# Altium schematic sheet MAX16998A Watchdog Circuit.SchDoc: Watchdog Circuit
size Letter; SheetNumber: 15
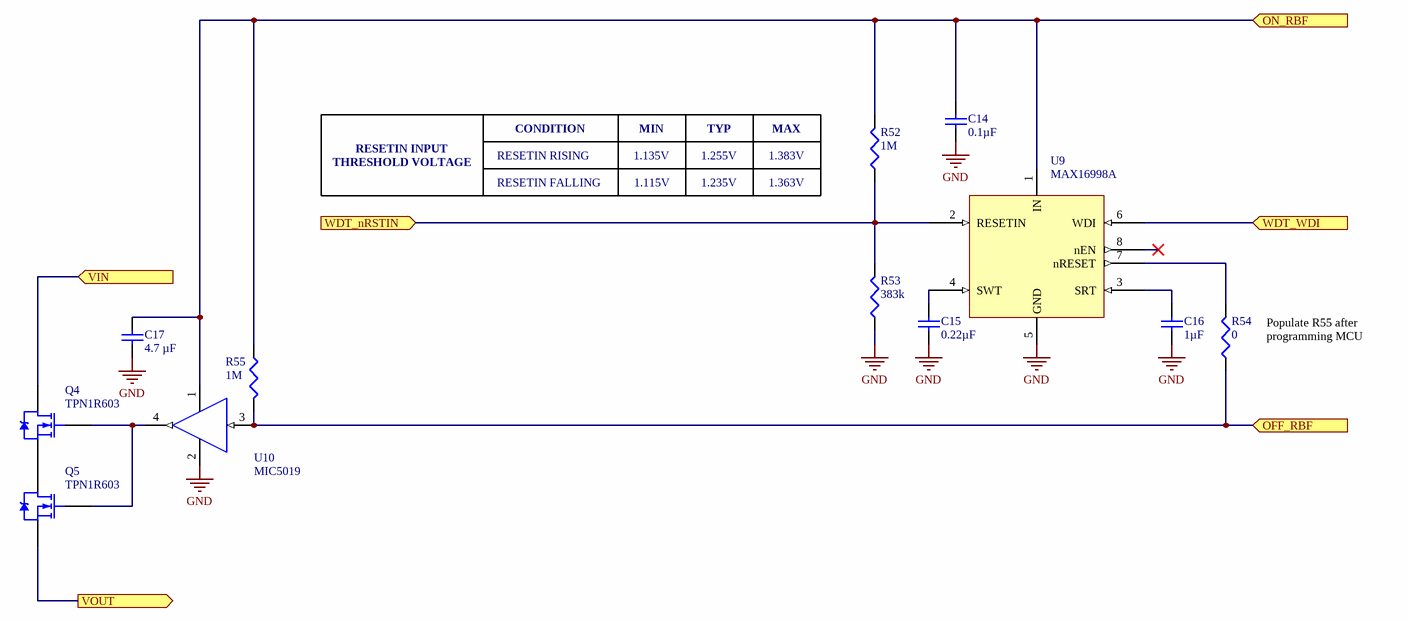
[diagram p0: MAX16998A Watchdog Circuit.SchDoc]

## Parts
C14  value 0.1µF  [TDK-CGA2B]  (hidden comment: Cap)
C15  value 0.22µF  [TDK-CGA3E]  (hidden comment: Cap)
C16  value 1µF  [TY-0603A]  (hidden comment: Cap)
C17  value 4.7 µF  [MUR-GRM188]  (hidden comment: Cap)
Q4  TPN1R603  [TOSH-S-3X1S]
Q5  TPN1R603  [TOSH-S-3X1S]
R52  value 1M  [PANA-ERJ2R]  (hidden comment: Res3)
R53  value 383k  [PANA-ERJ2R]  (hidden comment: Res3)
R54  value 0  [PANA-ERJ2G]  (hidden comment: Jumper)
R55  value 1M  [PANA-ERJ2R]  (hidden comment: Res3)
U9  MAX16998A  [MAX-21-0036]
U10  MIC5019  [MCP-MIC5019]

## Ports
OFF_RBF (in), ON_RBF (in), VIN (in), VOUT (out), WDT_nRSTIN (in), WDT_WDI (in)

## Nets
GND: C14.2 C15.1 C16.1 C17.1 R53.1 U9.5(GND) U10.2(GND)
OFF_RBF: R54.1 R55.1 U10.3(IN) ; port OFF_RBF
ON_RBF: C14.1 C17.2 R52.2 R55.2 U9.1(IN) U10.1(VDD) ; port ON_RBF
VIN: Q4.2(D) ; port VIN
VOUT: Q5.3(S) ; port VOUT
WDT_nRSTIN: R52.1 R53.2 U9.2(RESETIN) ; port WDT_nRSTIN
WDT_WDI: U9.6(WDI) ; port WDT_WDI
NetC15_2: C15.2 U9.4(SWT)
NetC16_2: C16.2 U9.3(SRT)
NetQ4_1: Q4.1(G) Q5.1(G) U10.4(OUT)
NetQ4_3: Q4.3(S) Q5.2(D)
NetR54_2: R54.2 U9.7(nRESET)

Not connected (* = marked no-connect by the designer): U9 8(nEN)*

## Notes on the sheet
- RESETIN INPUT
- THRESHOLD VOLTAGE
- RESETIN RISING
- CONDITION
- MIN
- 1.135V
- TYP
- 1.255V
- MAX
- 1.383V
- RESETIN FALLING
- 1.115V
- 1.235V
- 1.363V
- (near R54) Populate R55 after
- (near R54) programming MCU
- (the "License"); you may not use or redistribute this file except in compliance with the License. You
- This file and the information within it are licensed under the terms of the Apache License, Version 2.0
- Copyright
- Unless required by applicable law or agreed to in writing, content distributed under the License is
- distributed on an "AS IS" BASIS, WITHOUT WARRANTIES OR CONDITIONS OF ANY KIND,
- either express or implied. See the License for the specific language governing permissions and
- limitations under the License.
- may obtain a copy of the License at:
- http://www.apache.org/licenses/LICENSE-2.0
- Title
- Size:
- Date:
- Letter
- Number:
- Time:
- Revision:
- Sheet
- of
- University of Alberta
- Deptartment of Electrical
- and Computer Engineering
- Edmonton AB, Canada
- T6G 1H9
- File:

## Library data of the parts
C14 = PC-TDK-02259: CAP CER 0.1UF 50V X7R 0402; Manufacturer Part Number: CGA2B3X7R1H104K050BB; Index: 2259; Designator: C?; Tolerance: ±10%; Published: 2016-03-16; LatestRevisionDate: 2016-03-16; LatestRevisionNote: ...; PackageReference: 0402 (1005 Metric); Publisher: AlbertaSat; PackageDescription: Radial Cap, Thru-Hole; 2 Leads; 0.3 in Pin Spacing; Part Number: PC-TDK-02259; Supplier Part Number 1: 445-6899-1-ND; Supplier 1: Digi-key; Supplier Link: http://www.digikey.ca/product-search/en?keywords=445-6899-1-ND; Voltage - Rated: 50V; Temperature Coefficient: X7R; Applications: Automotive; Operating Temperature: -55°C ~ 125°C
C15 = PC-TDK-02393: CAP CER 0.22UF 50V X7R 0603; Manufacturer Part Number: CGA3E3X7R1H224K080AB; Index: 2393; Designator: C?; Tolerance: ±10%; Published: 2016-03-16; LatestRevisionDate: 2016-03-16; LatestRevisionNote: ...; PackageReference: 0603 (1608 Metric); Publisher: AlbertaSat; PackageDescription: Radial Cap, Thru-Hole; 2 Leads; 0.3 in Pin Spacing; Part Number: PC-TDK-02393; Supplier Part Number 1: 445-6926-1-ND; Supplier 1: Digi-key; Supplier Link: http://www.digikey.ca/product-search/en?keywords=445-6926-1-ND; Voltage - Rated: 50V; Temperature Coefficient: X7R; Applications: Automotive; Operating Temperature: -55°C ~ 125°C
C16 = PC-TY-00404: CAP CER 1UF 50V X7R 0603; Manufacturer Part Number: UMK107AB7105KA-T; Index: 404; Designator: C?; Tolerance: ±10%; Published: 2016-03-13; LatestRevisionDate: 2016-03-13; LatestRevisionNote: ...; PackageReference: 0603 (1608 Metric); Publisher: AlbertaSat; PackageDescription: Chip Capacitor, 2-Leads, Body 1.60x0.80mm, IPC Low Density; Part Number: PC-TY-00404; Supplier Part Number 1: 587-3247-1-ND; Supplier 1: Digi-key; Supplier Link: http://www.digikey.ca/product-search/en?keywords=587-3247-1-ND; Voltage-Rated: 50V; Temperature Coefficient: X7R; Application: General Purpose; Operating Temperature: -55°C ~ 125°C
C17 = 10165: CAP CER 4.7UF 16V X7R 0603; Part Number: 10165; Manufacturer Part Number: GRM188Z71C475KE21D; Designator: C?; Tolerance: ±10%; Voltage - Rated: 25V; Published: 8-Jun-2000; LatestRevisionDate: 17-Jul-2002; LatestRevisionNote: Re-released for DXP Platform.; PackageReference: 0603 (1608 Metric); Publisher: Altium Limited; PackageDescription: Chip Capacitor, 2-Leads, Body 1.60x0.80mm, IPC Low Density; Supplier Part Number 1: 490-GRM188Z71C475KE21DCT-ND; Supplier 1: Digi-Key; Supplier Link: #https://www.digikey.ca/en/products/detail/murata-electronics/GRM188Z71C475KE21D/13401930#; Temperature Coefficient: X7R; Application: General Purpose; Operating Temperature: -55°C ~ 125°C; Supplier 2: Mouser; Supplier Part Number 2: 81-GRM188Z71C475KE1D
Q4 Q5 = PU-TOSH-00002: X35 PB-F POWER MOSFET TRANSISTOR; Index: 2; Designator: Q?; Rds On: 1.6mOhm @ 40A, 10V; Part Number: PU-TOSH-00002; Manufacturer Part Number: TPN1R603PL,L1Q; Supplier Part Number 1: TPN1R603PLL1QCT-ND; Supplier 1: Digi-key; Supplier Part Number 2: 757-TPN1R603PLL1Q; Supplier 2: Mouser; Publisher: AlbertaSat; Published: 2020-04-01; LatestRevisionDate: 2020-04-01; LatestRevisionNote: ...; PackageReference: 8-TSON Advance (3.3x3.3); PackageDescription: SON, 8-Leads, Body 3.10x3.10mm, Pitch 0.65mm, Thermal Pad 2.49x2.06mm, IPC Low Density; Supplier Link: #https://www.digikey.ca/product-detail/en/toshiba-semiconductor-and-storage/TPN1R603PL-L1Q/TPN1R603PLL1QCT-ND/6570930#; Operating Temperature: -55°C ~ 175°C (TJ)
R52 R55 = 19704: RES SMD 1M OHM 1% 1/10W 0402; Part Number: 19704; Manufacturer Part Number: ERJ-2RKF1004X; Designator: R?; Power: 0.1W, 1/10W; Temperature Coefficient: ±100ppm/°C; Published: 8-Jun-2000; LatestRevisionDate: 29-May-2009; LatestRevisionNote: IPC-7351 Footprint Added.; PackageReference: 0402 (1005 Metric); Publisher: Altium Limited; PackageDescription: Chip Resistor, 2-Leads, Body 1.00x0.50mm, IPC Low Density; Supplier Part Number 1: P1.00MLCT-ND; Supplier 1: Digi-Key; Supplier Link: http://www.digikey.ca/product-search/en?keywords=P1.00MLCT-ND; Tolerance: ±1%; Operating Temperature: -55°C ~ 155°C
R53 = 19322: RES SMD 383K OHM 1% 1/10W 0402; Part Number: 19322; Manufacturer Part Number: ERJ-2RKF3833X; Designator: R?; Power: 0.1W, 1/10W; Temperature Coefficient: ±100ppm/°C; Published: 8-Jun-2000; LatestRevisionDate: 29-May-2009; LatestRevisionNote: IPC-7351 Footprint Added.; PackageReference: 0402 (1005 Metric); Publisher: Altium Limited; PackageDescription: Chip Resistor, 2-Leads, Body 1.00x0.50mm, IPC Low Density; Supplier Part Number 1: P383KLCT-ND; Supplier 1: Digi-Key; Supplier Link: http://www.digikey.ca/product-search/en?keywords=P383KLCT-ND; Tolerance: ±1%; Operating Temperature: -55°C ~ 155°C
R54 = 13127: RES SMD 0.0OHM JUMPER 1/10W 0402; Part Number: 13127; Manufacturer Part Number: ERJ-2GE0R00X; Designator: R?; Power: 0.1W, 1/10W; PackageDescription: Chip Resistor, 2-Leads, Body 1.00x0.50mm, IPC Low Density; Supplier Part Number 1: P0.0JCT-ND; Supplier 1: Digi-Key; Supplier Link: http://www.digikey.ca/product-search/en?keywords=P0.0JCT-ND; PackageReference: 0402 (1005 Metric); Tolerance: Jumper; Temperature Coefficient: -; Type: Jumper; Operating Temperature: -55°C ~ 155°C; Supplier 2: Mouser; Supplier Part Number 2: 667-ERJ-2GE0R00X
U9 = PU-MAX-00002: IC TIMER WATCHDOG 8UMAX; Manufacturer Part Number: MAX16998AAUA/V+; Index: 2; Designator: U?; Part Number: PU-MAX-00002; Supplier Part Number 1: MAX16998AAUA/V+-ND; Supplier 1: Digi-key; Supplier Part Number 2: 700-MAX16998AAUA/V+; Supplier 2: Mouser; Publisher: AlbertaSat; Published: 2017-04-06; LatestRevisionDate: 2023-05-04; LatestRevisionNote: Added operating temperature; PackageReference: 8-uMAX; PackageDescription: TSOP, 8-Leads, Body 3.00x3.00mm, Pitch 0.65mm, IPC Low Density; Supplier Link: https://www.digikey.ca/product-search/en?keywords=MAX16998AAUA/V+-ND; Applications: Automotive; Operating Temperature: -40°C ~ 125°C (TA)
U10 = PU-MCP-00008: IC GATE DRVR HIGH-SIDE 4TQFN; Index: 8; Designator: U?; Part Number: PU-MCP-00008; Manufacturer Part Number: MIC5019YFT-TR; Supplier Part Number 1: 576-4152-1-ND; Supplier 1: Digi-key; Supplier Part Number 2: 998-MIC5019YFTTR; Supplier 2: Mouser; Publisher: AlbertaSat; Published: 2020-04-01; LatestRevisionDate: 2020-04-01; LatestRevisionNote: ...; PackageReference: 4-TQFN (1.2x1.2); Supplier Link: #https://www.digikey.ca/en/products/detail/microchip-technology/MIC5019YFT-TR/3681038#; Operating Temperature: -40°C ~ 125°C (TJ)